# EAGLE design 555_project_breadboard_bp-a2_revA (EAGLE 7.6.0)
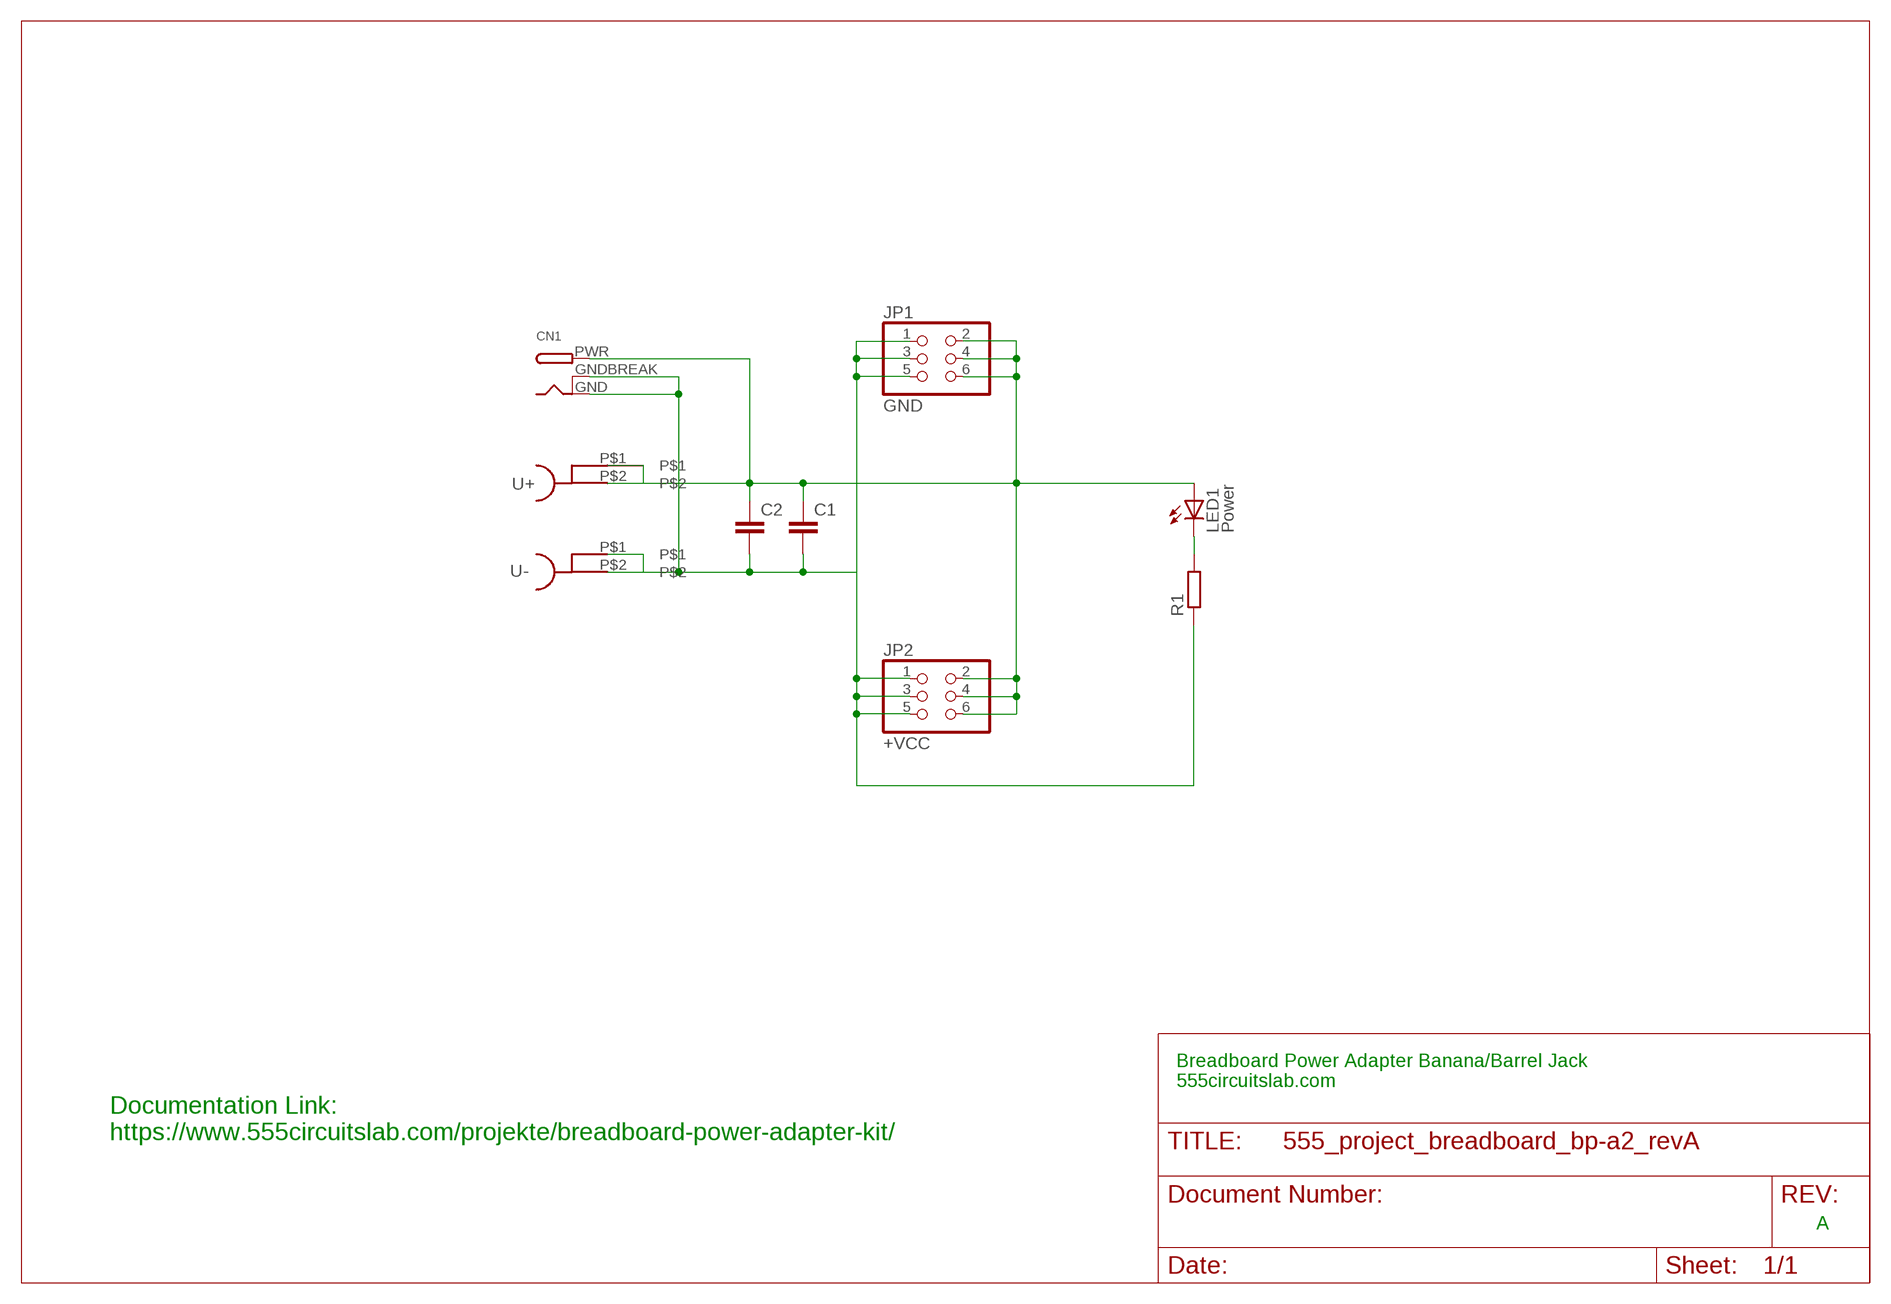
[diagram p0: schematic, sheet 1]

## Parts
C1  C-EU025-024X044  [C025-024X044]
C2  C-EU025-024X044  [C025-024X044]
CN1  DCBARRELPTH  [DCJACK_2MM_PTH]
JP1  GND  PINHD-2X3  [2X03]
JP2  +VCC  PINHD-2X3  [2X03]
LED1  Power  LED5MM  [LED5MM]
R1  R-EU_0204/7  [0204/7]
U+  PCB-BANANA  [PCB-BANANA]
U-  PCB-BANANA  [PCB-BANANA]

## Nets
GND: C1.2 C2.2 CN1.GND CN1.GNDBREAK JP1.1 JP1.3 JP1.5 JP2.1 JP2.3 JP2.5 R1.1 U-.P$1 U-.P$2
N$2: LED1.K(C) R1.2
VCC: C1.1 C2.1 CN1.PWR JP1.2 JP1.4 JP1.6 JP2.2 JP2.4 JP2.6 LED1.A U+.P$1 U+.P$2

## Notes on the sheet
- Breadboard Power Adapter Banana/Barrel Jack
  555circuitslab.com
- Documentation Link:
  https://www.555circuitslab.com/projekte/breadboard-power-adapter-kit/
- A

## Library data of the parts
C1 C2 = resistor:C-EU: CAPACITOR, European symbol
CN1 = adafruit:DCBARREL: 2.0mm DC Barrel Jack DCJACK_2MM_PTH - Through Hole Jack (4UConnector: 05537)
JP1 JP2 = pinhead:PINHD-2X3: PIN HEADER
LED1 = led:LED: LED OSRAM: - CHIPLED LG R971, LG N971, LY N971, LG Q971, LY Q971, LO R971, LY R971 LH N974, LH R974 LS Q976, LO Q976, LY Q976 LO Q996 - Hyper CHIPLED LW Q18S LB Q993, LB Q99A, LB R99A - SideLED LS A670, LO A670, LY A670, LG A670, LP A670 LB A673, LV A673, LT A673, LW A673 LH A674 LY A675 LS A676, LA A676, LO A676, LY A676, LW A676 LS A679, LY A679, LG A679 - Hyper Micro SIDELED® LS Y876, LA Y876, LO Y876, LY Y876 LT Y87S - SmartLED LW L88C, LW L88S LB L89C, LB L89S, LG L890 LS L89K, LO L89K, LY L89K LS L896, LA L896, LO L896, LY L896 - TOPLED LS T670, LO T670, LY T670, LG T670, LP T670 LSG T670, LSP T670, LSY T670, LOP T670, LYG T670 LG T671, LOG T671, LSG T671 LB T673, LV T673, LT T673, LW T673 LH T674 LS T676, LA T676, LO T676, LY T676, LB T676, LH T676, LSB T676, LW T676 LB T67C, LV T67C, LT T67C, LS T67K, LO T67K, LY T67K, LW E67C LS E67B, LA E67B, LO E67B, LY E67B, LB E67C, LV E67C, LT E67C LW T67C LS T679, LY T679, LG T679 LS T770, LO T770, LY T770, LG T770, LP T770 LB T773, LV T773, LT T773, LW T773 LH T774 LS E675, LA E675, LY E675, LS T675 LS T776, LA T776, LO T776, LY T776, LB T776 LHGB T686 LT T68C, LB T68C - Hyper Mini TOPLED® LB M676 - Mini TOPLED Santana® LG M470 LS M47K, LO M47K, LY M47K Source: http://www.osram.convergy.de LUXEON: - LUMILED® LXK2-PW12-R00, LXK2-PW12-S00, LXK2-PW14-U00, LXK2-PW14-V00 LXK2-PM12-R00, LXK2-PM12-S00, LXK2-PM14-U00 LXK2-PE12-Q00, LXK2-PE12-R00, LXK2-PE12-S00, LXK2-PE14-T00, LXK2-PE14-U00 LXK2-PB12-K00, LXK2-PB12-L00, LXK2-PB12-M00, LXK2-PB14-N00, LXK2-PB14-P00, LXK2-PB14-Q00 LXK2-PR12-L00, LXK2-PR12-M00, LXK2-PR14-Q00, LXK2-PR14-R00 LXK2-PD12-Q00, LXK2-PD12-R00, LXK2-PD12-S00 LXK2-PH12-R00, LXK2-PH12-S00 LXK2-PL12-P00, LXK2-PL12-Q00, LXK2-PL12-R00 Source: www.luxeon.com KINGBRIGHT: KA-3528ASYC Source: www.kingbright.com
R1 = resistor:R-EU_: RESISTOR, European symbol
U+ U- = PCB-Banana:PCB-BANANA

## Board
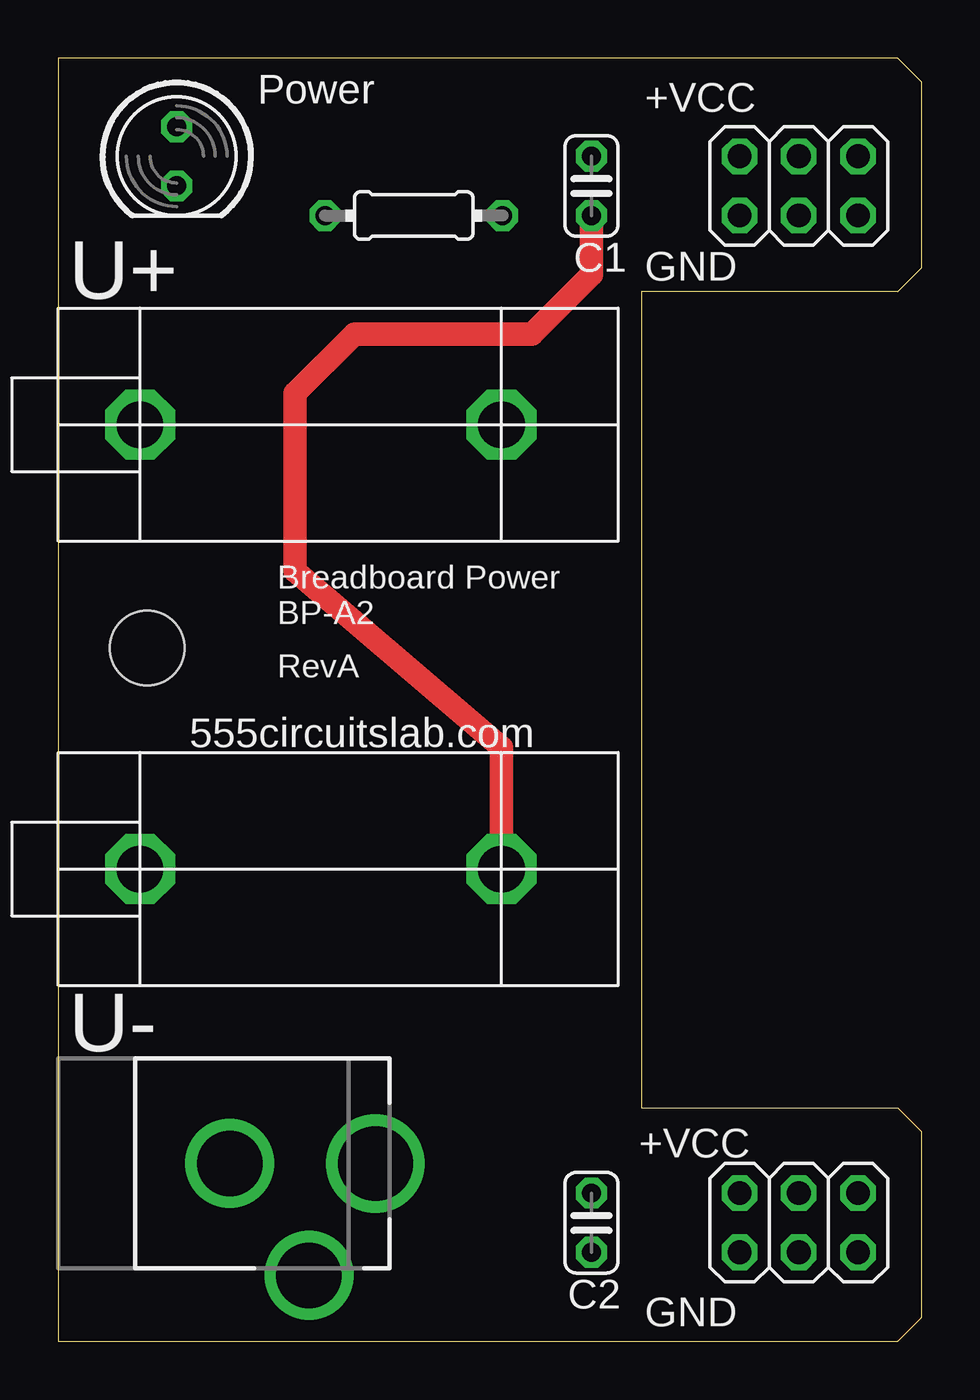
[diagram p1: board, top side]
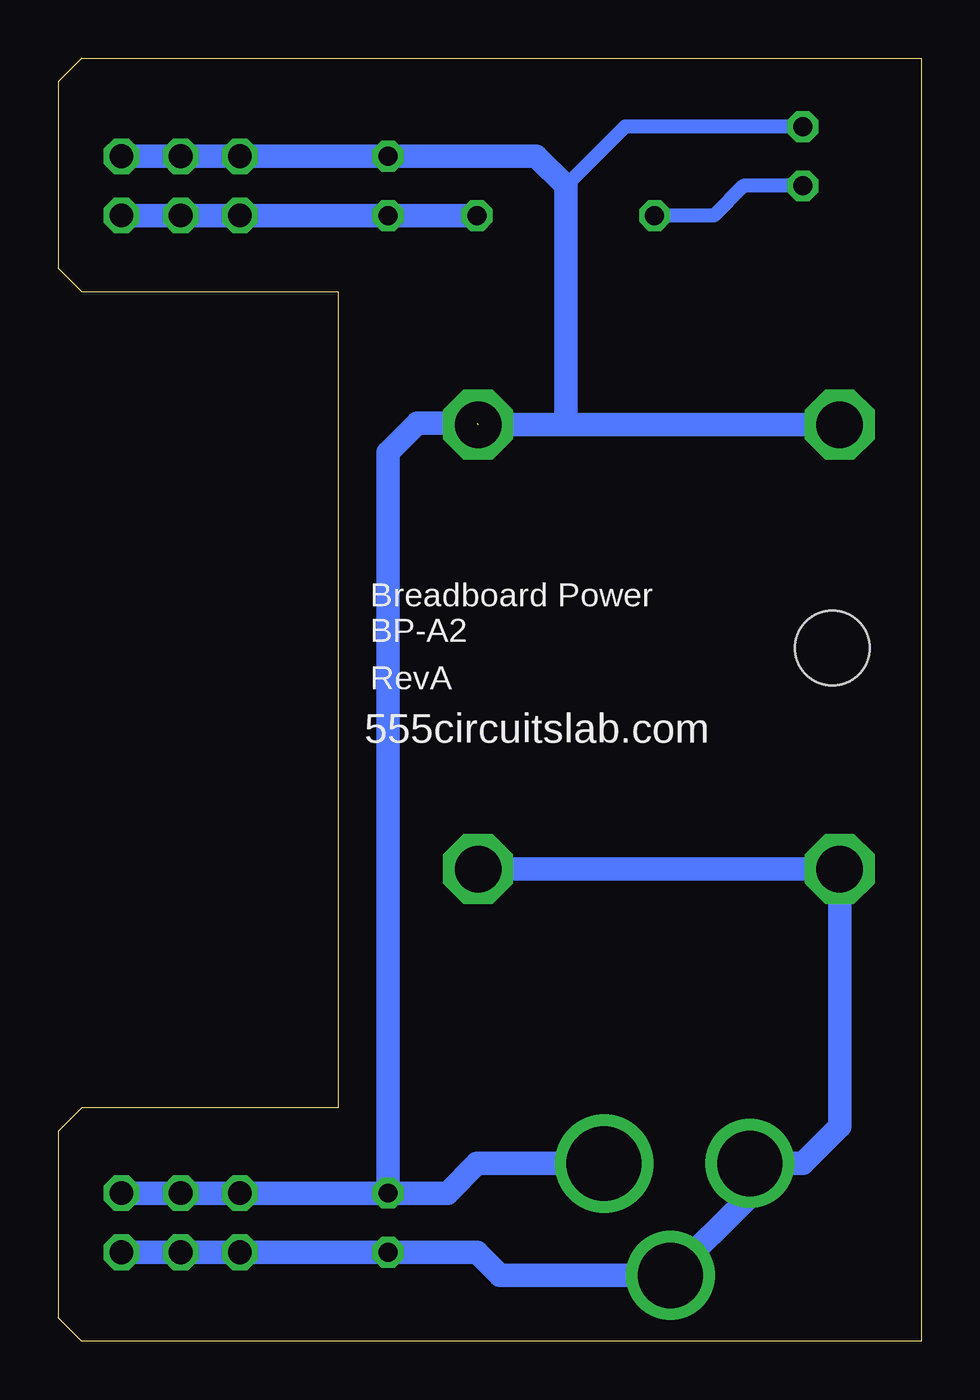
[diagram p2: board, bottom side, seen from below]

Size 37 x 55 mm. Coordinates in mm from the lower left corner, seen from the top.
Outline: 0,0 36,0 37,1 37,9 36,10 25,10 25,45 36,45 37,46 37,54 36,55 0,55 0,0
Copper layers (1*16): Top 0.035mm / dielectric 1.5mm / Bottom 0.035mm
Design rules "default": minimum track width 10mil, minimum drill 24mil, track to track 8mil, track to pad 8mil, pad to pad 8mil, via to via 8mil, smd to smd 8mil, copper to edge 40mil, drill to drill 8mil, minimum pad ring 10mil, minimum via ring 8mil, stop-mask expansion 4mil, vias tented up to drill 0mil, thermal gap 10mil
Holes 3.2 mm at 3.81,29.72

### Footprints (pad centres in the part's own frame; a part is rotated, then mirrored left to right if it is on the bottom)
C025-024X044 = drill 0.813 octagon: 1 -1.27,0; 2 1.27,0
DCJACK_2MM_PTH = drill 2.8: GND 0,7.35; GNDBREAK 4.8,10.75 | drill 3.2: PWR 0,13.6
2X03 = drill 1.016 octagon: 1 -2.54,-1.27; 2 -2.54,1.27; 3 0,-1.27; 4 0,1.27; 5 2.54,-1.27; 6 2.54,1.27
LED5MM = drill 0.813 octagon: A -1.27,0; K 1.27,0
0204/7 = drill 0.813 octagon: 1 -3.81,0; 2 3.81,0
PCB-BANANA = drill 2 octagon: P$1 -7.93,-0.08; P$2 7.57,-0.08

### Placement (x,y rotation side)
C1  22.86,49.53 270 top
C2  22.86,5.08 270 top
CN1  0,7.62 270 top
JP1  31.75,5.08 0 top
JP2  31.75,49.53 0 top
LED1  5.08,50.8 270 top
R1  15.24,48.26 180 top
U+  11.43,39.37 0 top
U-  11.43,20.32 0 top

### Tracks (layer width: path | path; a pad name or v marks a point on that pad's centre or on a via)
GND
  Top 1.016: U-.P$2 19,25.45 10.16,33.02 10.16,40.64 12.7,43.18 20.32,43.18 22.86,45.72 C1.2
  Bottom 1.016: U-.P$2 U-.P$1 3.5,9.2 5.08,7.62 CN1.GND 7.35,6.22 CN1.GNDBREAK 18.06,2.82 19.05,3.81 C2.2 JP1.1 JP1.3 JP1.5 | JP2.5 JP2.3 JP2.1 C1.2 R1.1
N$2
  Bottom 0.61: LED1.K 7.62,49.53 8.89,48.26 R1.2
VCC  (1 unrouted)
  Bottom 0.61: LED1.A 12.7,52.07 15.24,49.53
  Bottom 1.016: U+.P$1 15.24,39.29 | 15.24,39.29 U+.P$2 | JP1.6 JP1.4 JP1.2 C2.1 | CN1.PWR 19.05,7.62 20.32,6.35 C2.1 | JP2.6 JP2.4 JP2.2 C1.1 16.51,50.8 15.24,49.53 15.24,39.29 | C2.1 22.86,38.1 21.59,39.37 19.05,39.37

### Text on the board
tPlace: Breadboard Power / BP-A2 | RevA | 555circuitslab.com | +VCC
bPlace: Breadboard Power / BP-A2 | RevA | 555circuitslab.com
tNames: GND